# Altium schematic sheet 1010829PA_HVFlyback_GD_Testboard_GateDrive.SchDoc: Schematitel
size A3; CompanyName: drivetek ag; DrawnBy: NLE; Address1: industriestrasse 37; Address2: 2555 brügg; Address3: Switzerland; SheetNumber: 10; SheetTotal: 10; PageSetup: Record=PageOptions|CenterHorizontal=True|CenterVertical=True|PrintScale=1.00|XCorrection=1.00|YCorrection=1.00|PrintKind=1|BorderSize=5000000|LeftOffset=0|BottomOffset=0|Orientation=2|PaperLength=1000|PaperWidth=1000|Scale=100|PaperSource=7|PrintQuality=-4|MediaType=1|DitherType=10|PaperKind=A3|PrintScaleMode=1
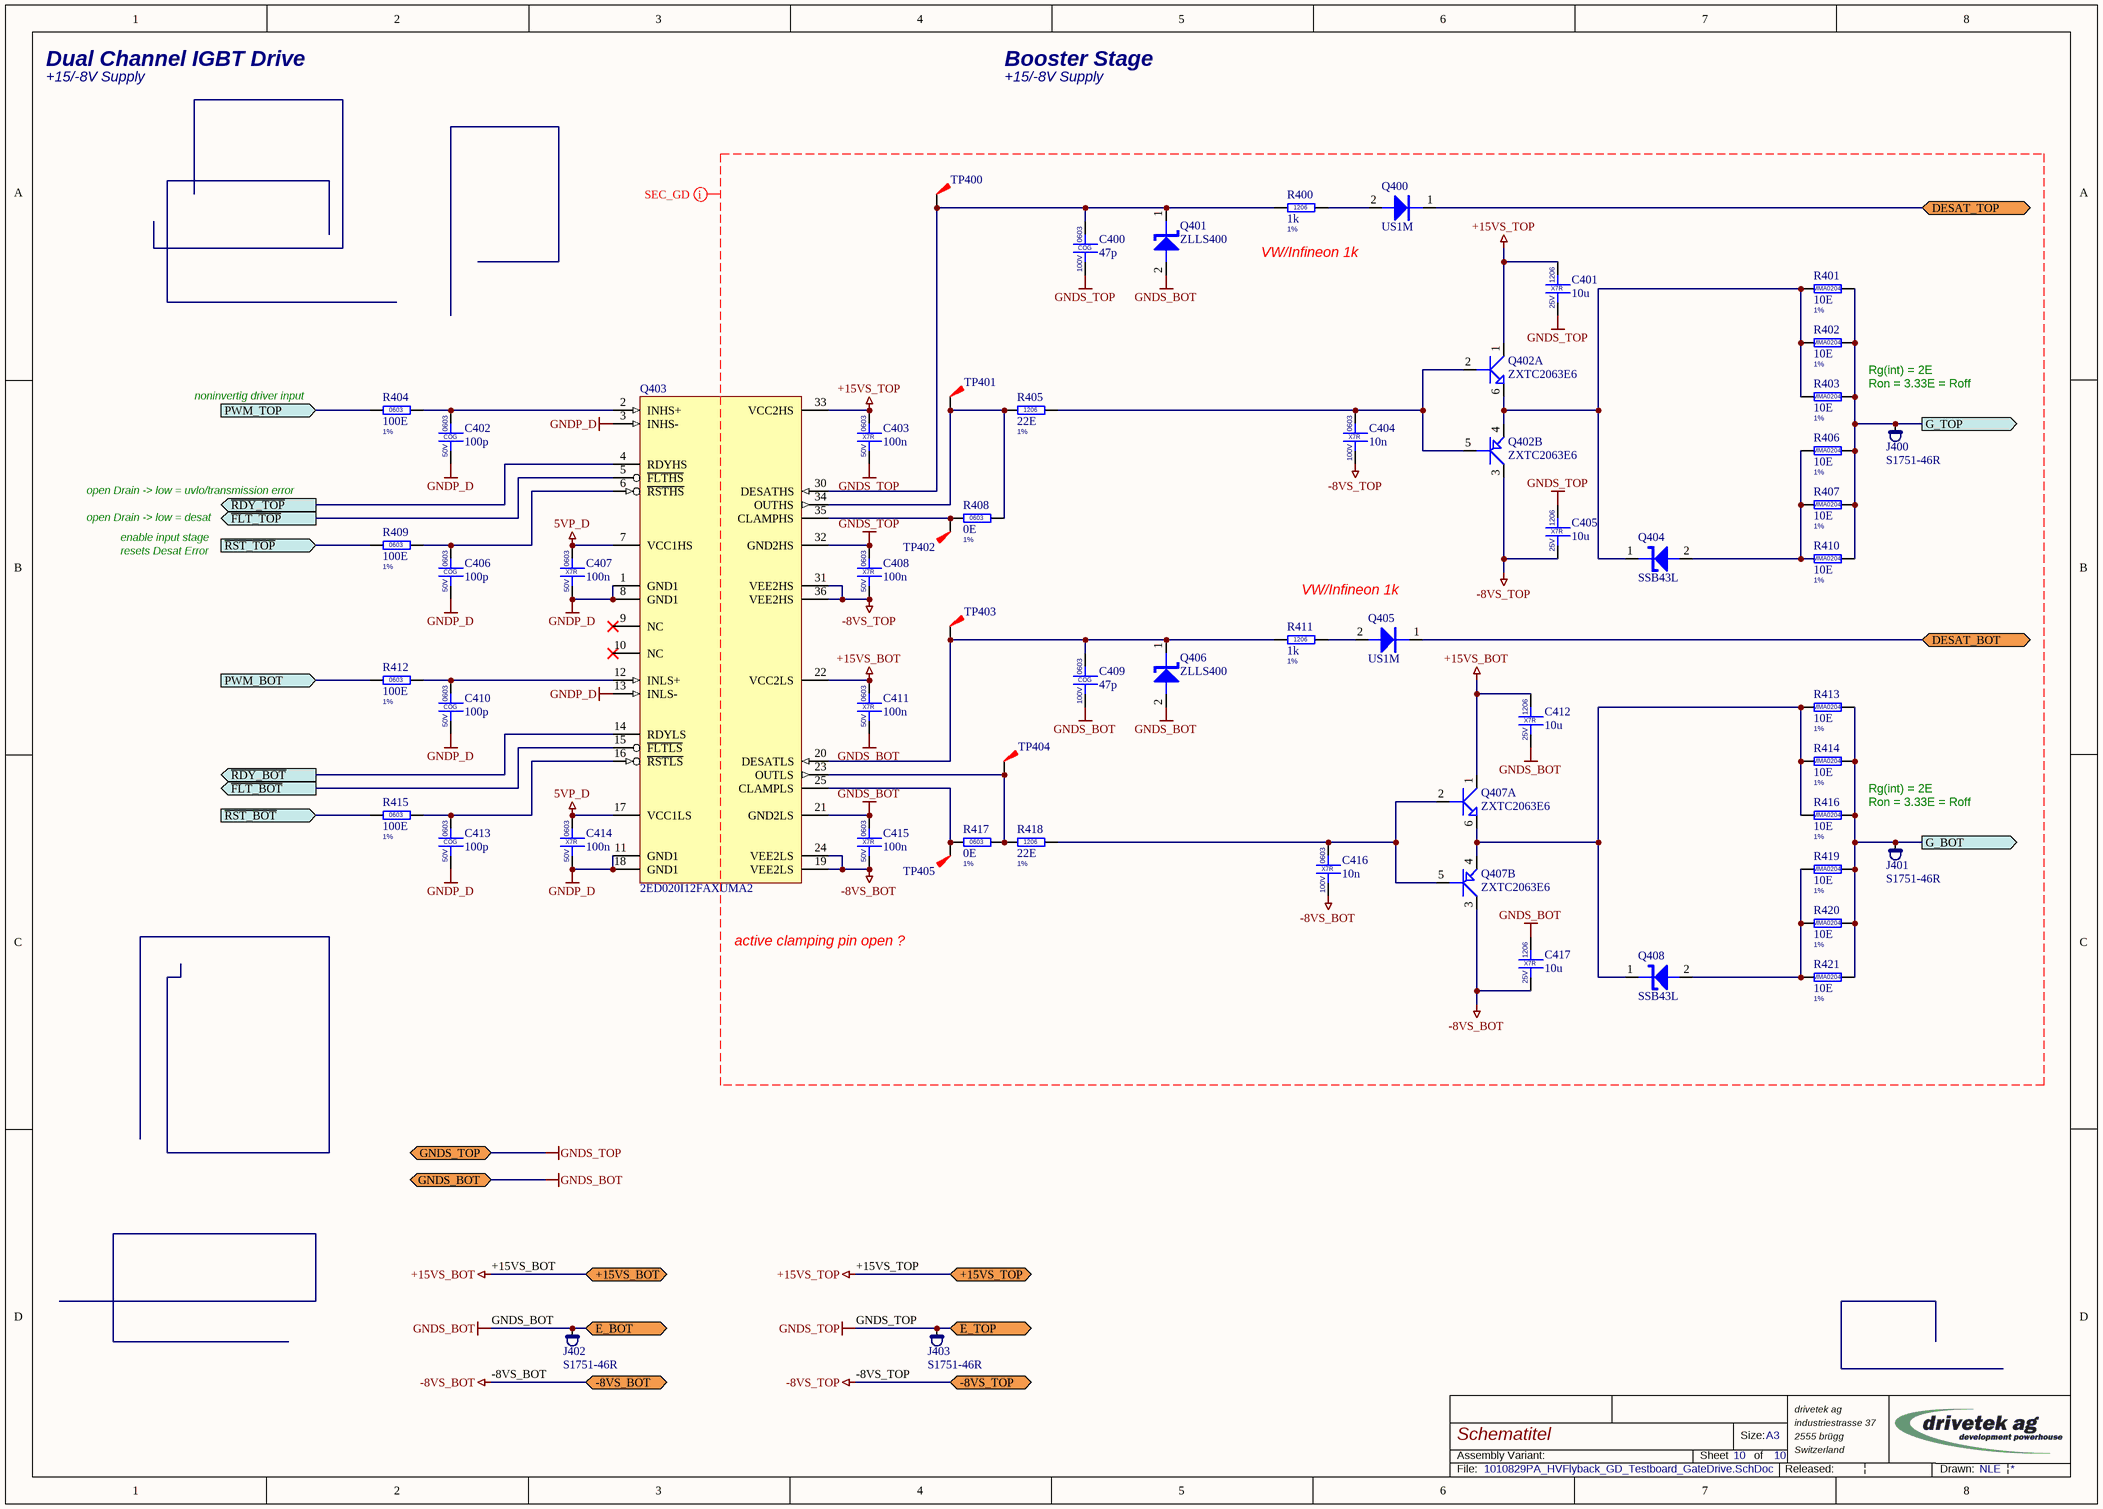
[diagram p0: 1010829PA_HVFlyback_GD_Testboard_GateDrive.SchDoc]

## Parts
C400  47p  CaseName: 0603  Type3: COG  Voltage: 100V  [02_0603_DRK_1-7x1-0x0-9]
C401  10u  Type3: X7R  Voltage: 25V  CaseName: 1206  [02_1206_DRK_3-4x1-8x1-8]
C402  100p  CaseName: 0603  Type3: COG  Voltage: 50V  [02_0603_DRK_1-7x1-0x0-9]
C403  100n  CaseName: 0603  Type3: X7R  Voltage: 50V  [02_0603_DRK_1-7x1-0x0-9]
C404  10n  CaseName: 0603  Type3: X7R  Voltage: 100V  [02_0603_DRK_1-7x1-0x0-9]
C405  10u  Type3: X7R  Voltage: 25V  CaseName: 1206  [02_1206_DRK_3-4x1-8x1-8]
C406  100p  CaseName: 0603  Type3: COG  Voltage: 50V  [02_0603_DRK_1-7x1-0x0-9]
C407  100n  CaseName: 0603  Type3: X7R  Voltage: 50V  [02_0603_DRK_1-7x1-0x0-9]
C408  100n  CaseName: 0603  Type3: X7R  Voltage: 50V  [02_0603_DRK_1-7x1-0x0-9]
C409  47p  CaseName: 0603  Type3: COG  Voltage: 100V  [02_0603_DRK_1-7x1-0x0-9]
C410  100p  CaseName: 0603  Type3: COG  Voltage: 50V  [02_0603_DRK_1-7x1-0x0-9]
C411  100n  CaseName: 0603  Type3: X7R  Voltage: 50V  [02_0603_DRK_1-7x1-0x0-9]
C412  10u  Type3: X7R  Voltage: 25V  CaseName: 1206  [02_1206_DRK_3-4x1-8x1-8]
C413  100p  CaseName: 0603  Type3: COG  Voltage: 50V  [02_0603_DRK_1-7x1-0x0-9]
C414  100n  CaseName: 0603  Type3: X7R  Voltage: 50V  [02_0603_DRK_1-7x1-0x0-9]
C415  100n  CaseName: 0603  Type3: X7R  Voltage: 50V  [02_0603_DRK_1-7x1-0x0-9]
C416  10n  CaseName: 0603  Type3: X7R  Voltage: 100V  [02_0603_DRK_1-7x1-0x0-9]
C417  10u  Type3: X7R  Voltage: 25V  CaseName: 1206  [02_1206_DRK_3-4x1-8x1-8]
J400  S1751-46R  [13_PAD_DRK_HARWIN_S1751-46]
J401  S1751-46R  [13_PAD_DRK_HARWIN_S1751-46]
J402  S1751-46R  [13_PAD_DRK_HARWIN_S1751-46]
J403  S1751-46R  [13_PAD_DRK_HARWIN_S1751-46]
Q400  US1M  [03_SMA_DRK]
Q401  ZLLS400  [03_SOD323_DRK]
Q402  ZXTC2063E6  [03_SOT23-6_DRK]  (parts A,B of 2)
Q403  2ED020I12FAXUMA2  [04_DSO-36_DRK]
Q404  SSB43L  [03_SMB_DRK]
Q405  US1M  [03_SMA_DRK]
Q406  ZLLS400  [03_SOD323_DRK]
Q407  ZXTC2063E6  [03_SOT23-6_DRK]  (parts A,B of 2)
Q408  SSB43L  [03_SMB_DRK]
R400  1k  Tolerance: 1%  CaseName: 1206  [01_1206_DRK_3-4x1-8x0-65]
R401  10E  Tolerance: 1%  CaseName: MMA0204  [01_MMA0204_DRK]
R402  10E  Tolerance: 1%  CaseName: MMA0204  [01_MMA0204_DRK]
R403  10E  Tolerance: 1%  CaseName: MMA0204  [01_MMA0204_DRK]
R404  100E  Tolerance: 1%  CaseName: 0603  [01_0603_DRK_1-7x1-0x0-55]
R405  22E  Tolerance: 1%  CaseName: 1206  [01_1206_DRK_3-4x1-8x0-65]
R406  10E  Tolerance: 1%  CaseName: MMA0204  [01_MMA0204_DRK]
R407  10E  Tolerance: 1%  CaseName: MMA0204  [01_MMA0204_DRK]
R408  0E  Tolerance: 1%  CaseName: 0603  [01_0603_DRK_1-7x1-0x0-55]
R409  100E  Tolerance: 1%  CaseName: 0603  [01_0603_DRK_1-7x1-0x0-55]
R410  10E  Tolerance: 1%  CaseName: MMA0204  [01_MMA0204_DRK]
R411  1k  Tolerance: 1%  CaseName: 1206  [01_1206_DRK_3-4x1-8x0-65]
R412  100E  Tolerance: 1%  CaseName: 0603  [01_0603_DRK_1-7x1-0x0-55]
R413  10E  Tolerance: 1%  CaseName: MMA0204  [01_MMA0204_DRK]
R414  10E  Tolerance: 1%  CaseName: MMA0204  [01_MMA0204_DRK]
R415  100E  Tolerance: 1%  CaseName: 0603  [01_0603_DRK_1-7x1-0x0-55]
R416  10E  Tolerance: 1%  CaseName: MMA0204  [01_MMA0204_DRK]
R417  0E  Tolerance: 1%  CaseName: 0603  [01_0603_DRK_1-7x1-0x0-55]
R418  22E  Tolerance: 1%  CaseName: 1206  [01_1206_DRK_3-4x1-8x0-65]
R419  10E  Tolerance: 1%  CaseName: MMA0204  [01_MMA0204_DRK]
R420  10E  Tolerance: 1%  CaseName: MMA0204  [01_MMA0204_DRK]
R421  10E  Tolerance: 1%  CaseName: MMA0204  [01_MMA0204_DRK]
TP400  TP THT Dia 0.8mm, Hole 0.3mm  [13_TP_0-3_0-8mm]  (value not drawn)  (no BOM)
TP401  TP THT Dia 0.8mm, Hole 0.3mm  [13_TP_0-3_0-8mm]  (value not drawn)  (no BOM)
TP402  TP THT Dia 0.8mm, Hole 0.3mm  [13_TP_0-3_0-8mm]  (value not drawn)  (no BOM)
TP403  TP THT Dia 0.8mm, Hole 0.3mm  [13_TP_0-3_0-8mm]  (value not drawn)  (no BOM)
TP404  TP THT Dia 0.8mm, Hole 0.3mm  [13_TP_0-3_0-8mm]  (value not drawn)  (no BOM)
TP405  TP THT Dia 0.8mm, Hole 0.3mm  [13_TP_0-3_0-8mm]  (value not drawn)  (no BOM)

## Ports
+15VS_BOT (bidir), +15VS_TOP (bidir), -8VS_BOT (bidir), -8VS_TOP (bidir), DESAT_BOT (bidir), DESAT_TOP (bidir), E_BOT (bidir), E_TOP (bidir), G_BOT (out), G_TOP (out), GNDS_BOT (bidir), GNDS_TOP (bidir), PWM_BOT (in), PWM_TOP (in), ~{FLT_BOT} (out), ~{FLT_TOP} (out), ~{RDY_BOT} (out), ~{RDY_TOP} (out), ~{RST_BOT} (in), ~{RST_TOP} (in)

## Nets
5VP_D: C407.1 C414.1 Q403.7(VCC1HS) Q403.17(VCC1LS)
+15VS_BOT: C411.1 C412.1 Q403.22(VCC2LS) Q407.1 ; port +15VS_BOT
+15VS_TOP: C401.1 C403.1 Q402.1 Q403.33(VCC2HS) ; port +15VS_TOP
-8VS_BOT: C415.2 C416.2 C417.2 Q403.19(VEE2LS) Q403.24(VEE2LS) Q407.3 ; port -8VS_BOT
-8VS_TOP: C404.2 C405.2 C408.2 Q402.3 Q403.31(VEE2HS) Q403.36(VEE2HS) ; port -8VS_TOP
GNDP_D: C402.2 C406.2 C407.2 C410.2 C413.2 C414.2 Q403.1(GND1) Q403.3(INHS-) Q403.8(GND1) Q403.11(GND1) Q403.13(INLS-) Q403.18(GND1)
GNDS_BOT: C409.2 C411.2 C412.2 C415.1 C417.1 J402.1 Q401.2 Q403.21(GND2LS) Q406.2 ; port E_BOT, port GNDS_BOT
GNDS_TOP: C400.2 C401.2 C403.2 C405.1 C408.1 J403.1 Q403.32(GND2HS) ; port E_TOP, port GNDS_TOP
~{FLT_BOT}: Q403.15(~{FLTLS}) ; port ~{FLT_BOT}
~{FLT_TOP}: Q403.5(~{FLTHS}) ; port ~{FLT_TOP}
~{RDY_BOT}: Q403.14(RDYLS) ; port ~{RDY_BOT}
~{RDY_TOP}: Q403.4(RDYHS) ; port ~{RDY_TOP}
~{RST_BOT}: R415.1 ; port ~{RST_BOT}
~{RST_TOP}: R409.1 ; port ~{RST_TOP}
DESAT_BOT: Q405.1 ; port DESAT_BOT
DESAT_TOP: Q400.1 ; port DESAT_TOP
G_BOT: J401.1 R413.1 R414.1 R416.1 R419.1 R420.1 R421.1 ; port G_BOT
G_TOP: J400.1 R401.1 R402.1 R403.1 R406.1 R407.1 R410.1 ; port G_TOP
PWM_BOT: R412.1 ; port PWM_BOT
PWM_TOP: R404.1 ; port PWM_TOP
NetC400_1: C400.1 Q401.1 Q403.30(DESATHS) R400.1 TP400.1
NetC402_1: C402.1 Q403.2(INHS+) R404.2
NetC404_1: C404.1 Q402.2 Q402.5 R405.1
NetC406_1: C406.1 Q403.6(~{RSTHS}) R409.2
NetC409_1: C409.1 Q403.20(DESATLS) Q406.1 R411.1 TP403.1
NetC410_1: C410.1 Q403.12(INLS+) R412.2
NetC413_1: C413.1 Q403.16(~{RSTLS}) R415.2
NetC416_1: C416.1 Q407.2 Q407.5 R418.1
NetQ400_2: Q400.2 R400.2
NetQ402_4: Q402.4 Q402.6 Q404.1 R401.2 R402.2 R403.2
NetQ403_23: Q403.23(OUTLS) R417.1 R418.2 TP404.1
NetQ403_25: Q403.25(CLAMPLS) R417.2 TP405.1
NetQ403_34: Q403.34(OUTHS) R405.2 R408.2 TP401.1
NetQ403_35: Q403.35(CLAMPHS) R408.1 TP402.1
NetQ404_2: Q404.2 R406.2 R407.2 R410.2
NetQ405_2: Q405.2 R411.2
NetQ407_4: Q407.4 Q407.6 Q408.1 R413.2 R414.2 R416.2
NetQ408_2: Q408.2 R419.2 R420.2 R421.2

Not connected (* = marked no-connect by the designer): Q403 9(NC)* 10(NC)*

## Layout directives
net class SEC_GD: +15VS_BOT, +15VS_TOP, -8VS_BOT, -8VS_TOP, GNDS_BOT, GNDS_TOP

## Notes on the sheet
- Dual Channel IGBT Drive
- +15/-8V Supply
- Booster Stage
- VW/Infineon 1k
- Ron = 3.33E = Roff
- Rg(int) = 2E
- noninvertig driver input
- open Drain -> low = uvlo/transmission error
- open Drain -> low = desat
- resets Desat Error
- enable input stage
- active clamping pin open ?
- Assembly Variant:
- Sheet
- Size:
- of
- A3
- File:
- Released:
- |
- Drawn:

## Library data of the parts
C400 C409 = 02-0270: Part Description: Ceramic 0603 47pF 100V COG Flexiterm; Manufacturer 1: Kemet; Manufacturer Part Number 1: C0603X470J1GACTU; LatestRevision Note: Initial; Type1: CAP; Type2: Ceramic; Tolerance: 5; Order Number: 80-C0603X470J1G; Part Number: 02-0270; Author: RLE; PartValue: 47p; ROHS: True; ComponentLink1Description: Datasheet; ComponentLink1URL: http://www.kemet.com/kemet/web/homepage/kechome.nsf/file/Flexible%20Termination%20Ceramic%20Chip%20Capacitors%20%28FT-CAP%29/$file/KEM_C1013_X7R_FT-CAP_SMD.pdf; LatestRevision Date: 22.06.2012; Distributor: Mouser; Price: 0.36
C401 C405 C412 C417 = 02-0262: Part Description: Ceramic 1206 10uF 25V X7R flexiterm, automotive; Manufacturer 1: TDK; Manufacturer Part Number 1: CGA5L1X7R1E106M160AE; Type1: CAP; Type2: Ceramic; Tolerance: 20; Order Number: 445-7969-1-ND; LatestRevision Note: Initial; Order Number 2: 810-CGA5L1X7R1E106KS; Part Number: 02-0262; Author: CBA; PartValue: 10u; ROHS: True; ComponentLink1Description: Datasheet; ComponentLink1URL: http://tdk.com/pdf/automotive_B11.pdf; Distributor: Digikey; Price: 1.24; LatestRevision Date: 15.06.2012; Distributor 2: Mouser; Manufacturer 2: TDK; Manufacturer Part Number 2: CGA5L1X7R1E106K160AE
C402 C406 C410 C413 = 02-0380: Part Description: Ceramic 0603 100pF 50V 5% C0G  AEC-Q200; Manufacturer 1: Murata; Manufacturer Part Number 1: GCM1885C1H101JA16D; LatestRevision Note: Initial; Type1: CAP; Type2: Ceramic; Tolerance: 5; Order Number: 81-GCM1885C1H101JA6D; Part Number: 02-0380; Author: RLE; PartValue: 100p; ROHS: True; ComponentLink1Description: Datasheet; ComponentLink1URL: http://www.murata.com/products/catalog/pdf/c03e.pdf; LatestRevision Date: 12.09.2016; Distributor: Mouser; Price: 0.1
C403 C407 C408 C411 C414 C415 = 02-0342: Part Description: Ceramic 0603 100nF 50V X7R, AEC-Q200, Fail-Save, Deflecting Crack; Manufacturer 1: Murata; Manufacturer Part Number 1: GCJ188R71H104KA12D; LatestRevision Note: Initial; Type1: CAP; Type2: Ceramic; Tolerance: 10; Order Number: 81-GCJ188R71H104KA2D; Part Number: 02-0342; Author: RLE; PartValue: 100n; ROHS: True; ComponentLink1Description: Datasheet; ComponentLink1URL: http://www.murata.com/~/media/webrenewal/support/library/catalog/products/capacitor/mlcc/c03e.ashx; LatestRevision Date: 15.07.2015; Distributor: Mouser; Price: 0.257
C404 C416 = 02-0313: Part Description: Ceramic 0603 10n 100V 10% X7R, AEC-Q200; Manufacturer 1: Murata; Manufacturer Part Number 1: GCM188R72A103KA37D; LatestRevision Note: Initial; Type1: CAP; Type2: Ceramic; Tolerance: 10; Order Number: 81-GCM188R72A103KA7D; Part Number: 02-0313; Author: RLE; PartValue: 10n; ROHS: True; ComponentLink1Description: Datasheet; ComponentLink1URL: http://psearch.murata.com/capacitor/product/GCM1885C1H100JA16%23.pdf; LatestRevision Date: 25.06.2014; Distributor: Mouser; Price: 0.1
J400-J403 = 13-0487: Probe Hook; Part Description: SMD Probe Hook 2mm HIGH, 3.45x1.85mm; Manufacturer 1: Harwin; LatestRevision Note: Initial; Type1: TP; Type2: SMD; Order Number: 952-1478-2-ND; Order Number 2: 855-S1751-46R; Part Number: 13-0487; Author: CSI; PartValue: S1751-46R; ROHS: True; ComponentLink1Description: Datasheet; ComponentLink1URL: https://cdn.harwin.com/pdfs/60page187.pdf; LatestRevision Date: 19.09.2016; Manufacturer Part Number 1: S1751-46R; Distributor: DigiKey; Price: 0.25; Distributor 2: Mouser
Q400 Q405 = 03-0182: Part Description: Ultra Fast Recovery Rectifier, 1000V / 1A / 75ns; Manufacturer 1: Vishay; Manufacturer Part Number 1: US1MHE3_A/H; LatestRevision Note: Initial; Type1: DIODE; Type2: Power; Voltage: 1000V; Current: 1A; Order Number: 78-US1MHE3_A/H; Order Number 2: 78-US1MHE3_A/I; Part Number: 03-0182; Author: RLE; PartValue: US1M; CaseName: SMA; ROHS: True; ComponentLink1Description: Datasheet; ComponentLink1URL: http://www.vishay.com/docs/88768/88768.pdf; LatestRevision Date: 29.12.2011; Distributor: Mouser; Price: 0.225; Distributor 2: Mouser
Q401 Q406 = 03-0389: Part Description: Low VF, fast switching Schottky, extremely low leakage; Manufacturer 1: Diodes; Manufacturer Part Number 1: ZLLS400TA; LatestRevision Note: Checked; Type1: DIODE; Type2: Signal; Voltage: 40V; Current: 520m; Order Number: 522-ZLLS400TA; Checked: CRA; Part Number: 03-0389; Author: RLE; PartValue: ZLLS400; CaseName: SOD323; ROHS: True; ComponentLink1Description: Datasheet; ComponentLink1URL: http://www.diodes.com/_files/datasheets/ZLLS400.pdf; LatestRevision Date: 24.03.2016; Distributor: Mouser; Price: 0.413
Q402 Q407 = 03-0248: Part Description: 40V /3.5A  Complementary (NPN/PNP) Medium Power Transistor, AEC-Q 101; Manufacturer 1: Diodes Inc; LatestRevision Note: Initial; Type2: Power; Voltage: 40V; Current: 3A5; Order Number: 522-ZXTC2063E6TA; Order Number 2: ZXTC2063E6CT-ND; Part Number: 03-0248; Author: RLE; PartValue: ZXTC2063E6; CaseName: SOT23-6; ROHS: True; ComponentLink1Description: Datasheet; ComponentLink1URL: http://www.diodes.com/datasheets/ZXTC2063E6.pdf; LatestRevision Date: 13.12.2013; Manufacturer Part Number 1: ZXTC2063E6; Distributor: Mouser; Price: 0.745; Distributor 2: DigiKey
Q403 = 04-0486: Dual IGBT Driver IC; Manufacturer: Infineon Technologies; Part Description: Galvanic isolated dual channel IGBT driver - 2A; Manufacturer 1: Infineon; LatestRevision Note: Initial; Type1: MIXSIG; Order Number: 2762284; Order Number 2: 726-2ED020I12FAXUMA2; ManufacturerPartNumber: 2ED020I12FA; PackageReference: PG-DSO-36; Part Number: 04-0486; Author: RVI; PartValue: 2ED020I12FAXUMA2; CaseName: DSO-36; ROHS: True; ComponentLink1Description: Datasheet; ComponentLink1URL: https://www.infineon.com/dgdl/Infineon-2ED020I12FA-DS-v03_01-EN.pdf?fileId=db3a30432e779412012e7b87d2b23878; LatestRevision Date: 21.07.2017; Manufacturer Part Number 1: 2ED020I12FAXUMA2; Distributor: Farnell; Price: 9.96; Distributor 2: Mouser
Q404 Q408 = 03-0112: Part Description: High current density schottky rectifier; Manufacturer 1: Vishay; LatestRevision Note: Checked; Type1: DIODE; Type2: Power; Voltage: 30V; Current: 4A; Order Number: SSB43L-E3/52TGICT-ND; Checked: HHU; Part Number: 03-0112; Author: MSC; PartValue: SSB43L; CaseName: SMB; ROHS: True; ComponentLink1Description: Datasheet; ComponentLink1URL: http://www.vishay.com/docs/88884/ssb43l.pdf; LatestRevision Date: 27.11.2008; Manufacturer Part Number 1: SSB43L; Distributor: Digikey; Price: 0.45
R400 R411 = 01-0257: Part Description: 1206 1k 200V 0.125W 1%; Manufacturer 1: Multicomp; Manufacturer Part Number 1: MC 0.125W1206 1% 1K; LatestRevision Note: Checked; Type1: RES; Type2: Thickfilm; Voltage: 200V; Power: 125m; Checked: CBA; Order Number: 9335757; Part Number: 01-0257; Author: CBA; PartValue: 1k; ROHS: True; ComponentLink1Description: Datasheet; ComponentLink1URL: http://www.farnell.com/datasheets/90824.pdf; LatestRevision Date: 06.10.2006; Distributor: Farnell; Price: 0.055
R401 R402 R406 R407 R410 R413 R414 R419-R421 = 01-0574: Part Description: Mini-Melf 10R 200V 0.25W; Manufacturer 1: Vishay; Manufacturer Part Number 1: MMA02040C1009F; LatestRevision Note: Initial; Type1: RES; Type2: Metalfilm; Voltage: 200V; Power: 250m; Order Number: 594-MMA02040C1009FB3; Order Number 2: 3087542; Part Number: 01-0574; Author: MFR; PartValue: 10E; ROHS: True; ComponentLink1Description: Datasheet; ComponentLink1URL: http://www.vishay.com/docs/28713/melfprof.pdf; LatestRevision Date: 15.06.2012; Distributor: Mouser; Price: 0.1; Distributor 2: Farnell
R403 R416 = 01-0574: Part Description: Mini-Melf 10R 200V 0.25W; Manufacturer 1: Vishay; Manufacturer Part Number 1: MMA02040C1009F; LatestRevision Note: Initial; Type1: RES; Type2: Metalfilm; Power: 250m; Order Number: 594-MMA02040C1009FB3; Voltage: 200V; Order Number 2: 3087542; Part Number: 01-0574; Author: MFR; PartValue: 10E; ROHS: True; ComponentLink1Description: Datasheet; ComponentLink1URL: http://www.vishay.com/docs/28713/melfprof.pdf; LatestRevision Date: 15.06.2012; Distributor: Mouser; Price: 0.1; Distributor 2: Farnell
R404 R409 R412 R415 = 01-0770: Part Description: 0603 100E 75VV 0.1W 1% 100ppm, AEC-Q200; Manufacturer 1: Panasonic; Manufacturer Part Number 1: ERJ3EKF1000V; LatestRevision Note: Inital; Type1: RES; Type2: Thickfilm; Voltage: 75V; Power: 100m; Order Number: 2303059; Part Number: 01-0770; Author: RVI; PartValue: 100E; ROHS: True; ComponentLink1Description: Datasheet; ComponentLink1URL: http://www.farnell.com/datasheets/2111203.pdf?_ga=2.233800540.312604292.1501488576-657638312.1494329784; LatestRevision Date: 31.07.2017; Distributor: Farnell; Price: 0.05
R405 R418 = 01-0675: Part Description: 1206 22E 200V 500mW 1% AEC-Q200; Manufacturer 1: Vishay; Manufacturer Part Number 1: CRCW120622R0FKEAHP; LatestRevision Note: Initial; Type1: RES; Type2: Thickfilm; Voltage: 200V; Power: 500m; Order Number: 71-CRCW120622R0FKEAH; Order Number 2: 541-22.0UTR-ND; Part Number: 01-0675; Author: CSI; PartValue: 22E; ROHS: True; ComponentLink1Description: Datasheet; ComponentLink1URL: http://www.vishay.com/docs/20043/crcwhpe3.pdf; LatestRevision Date: 27.01.2015; Distributor: Mouser; Price: 0.098; Distributor 2: Digikey
R408 R417 = 01-0128: Part Description: 0603 0E 50V 0.063W 1%; Manufacturer 1: Multicomp; Manufacturer Part Number 1: MC 0.063W 0603 0R; LatestRevision Note: Checked; Type1: RES; Type2: Thickfilm; Voltage: 50V; Power: 63m; Checked: CBA; Order Number: 9331662; Part Number: 01-0128; Author: CBA; PartValue: 0E; ROHS: True; ComponentLink1Description: Datasheet; ComponentLink1URL: http://www.farnell.com/datasheets/90824.pdf; LatestRevision Date: 06.10.2006; Distributor: Farnell; Price: 0.06
TP400-TP405 = 13-0524: Part Description: Test point THT - Dia 0.8mm, Hole 0.3mm; LatestRevision Note: Initial; Type2: TH; Part Number: 13-0524; Author: RVI; Type1: TP; PartValue: TP THT Dia 0.8mm, Hole 0.3mm; CaseName: 0.8mm; ROHS: True; ComponentLink1Description: Datasheet; LatestRevision Date: 10.07.2017; Price: 0